# EAGLE design 77seg_panel_ends (EAGLE 6.2)
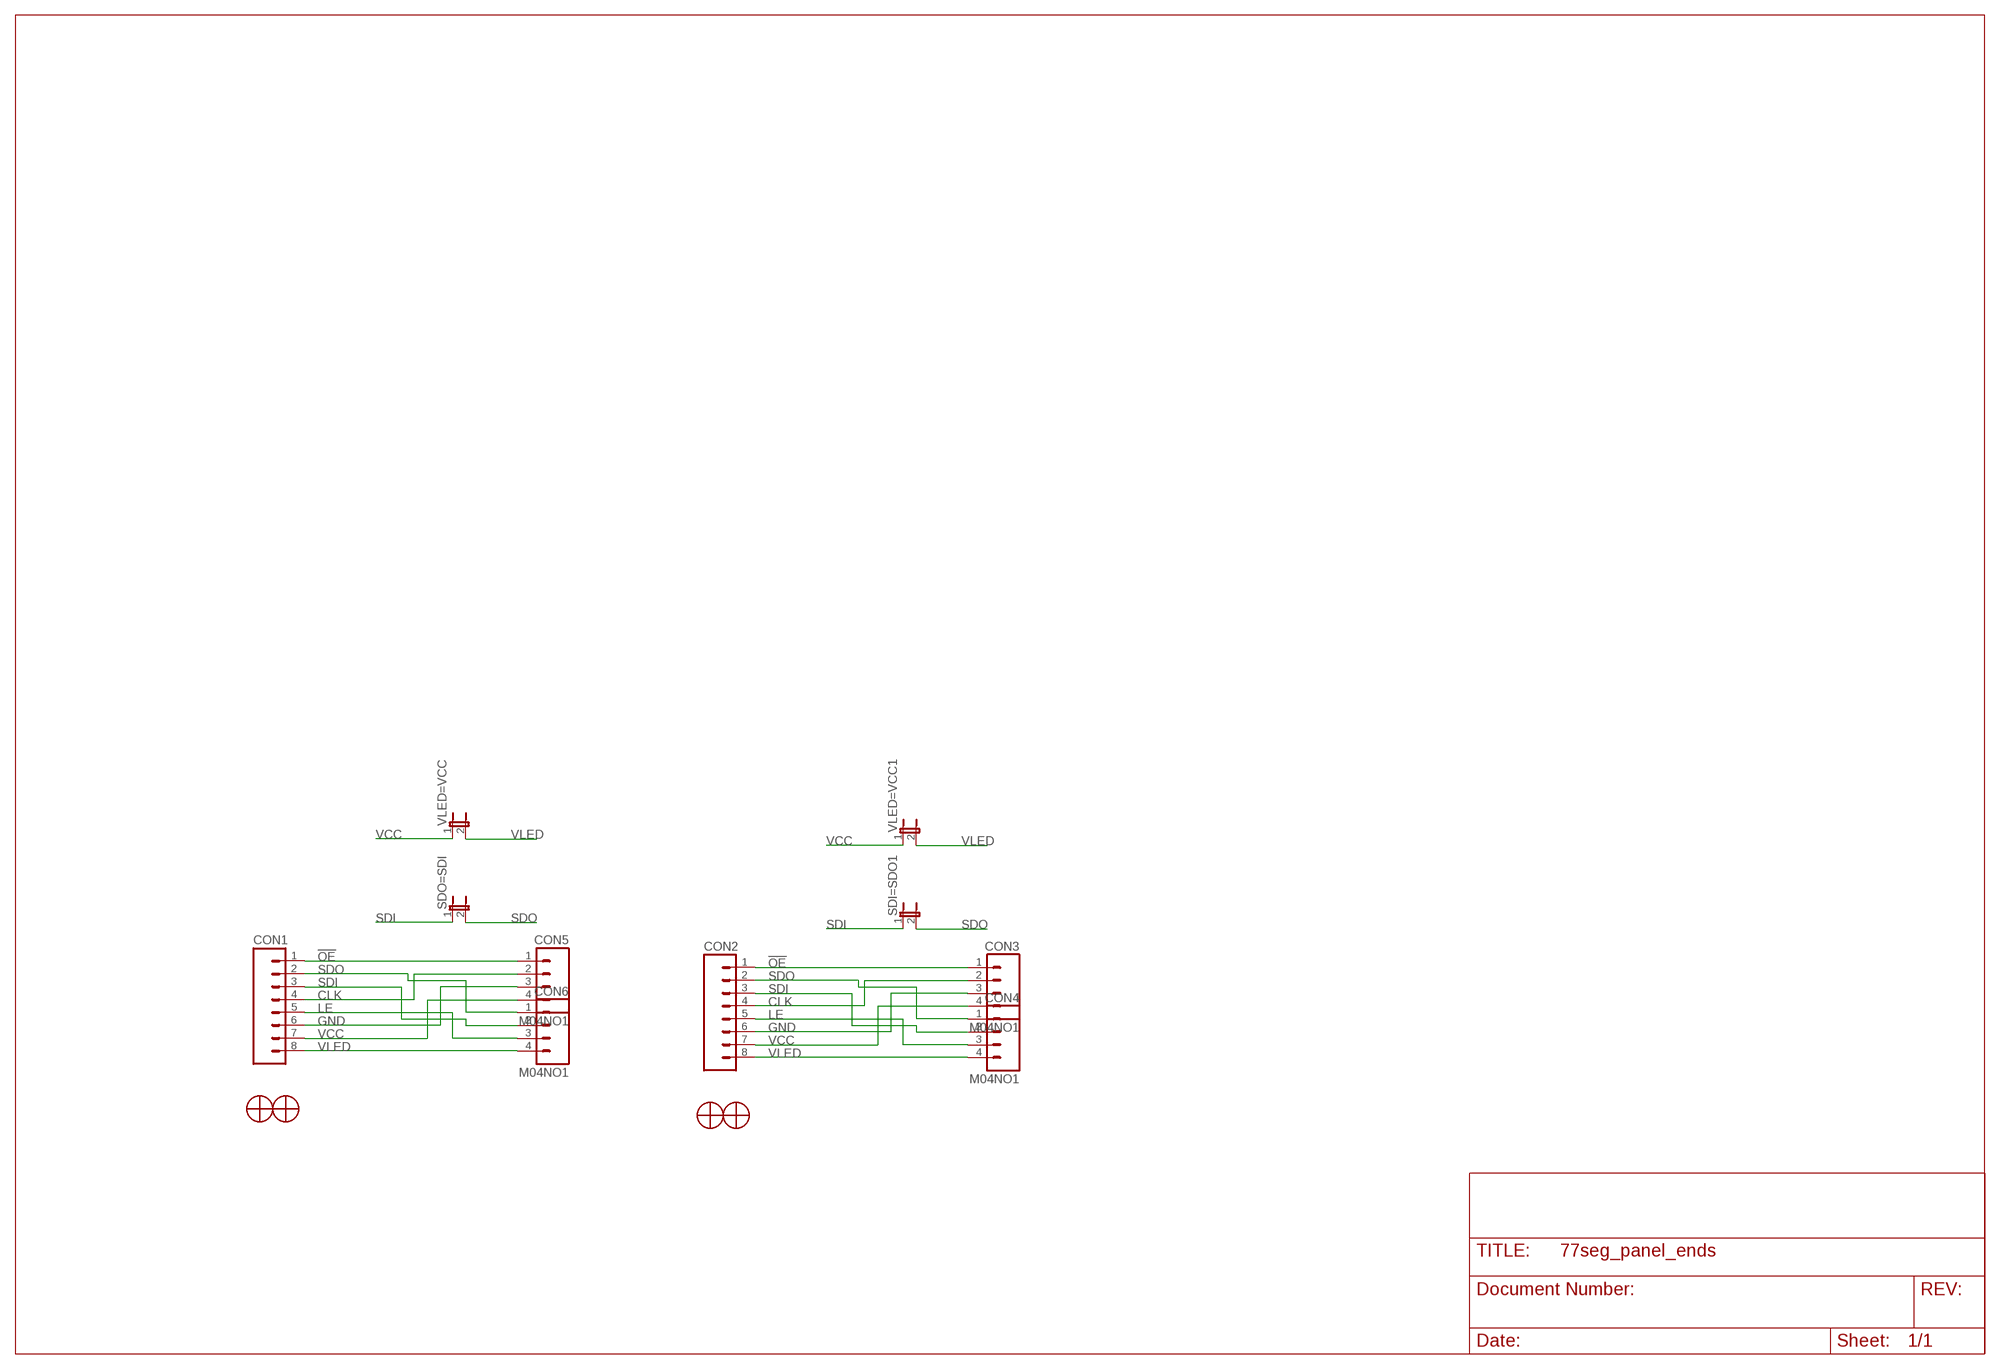
[diagram p0: schematic, sheet 1]

## Parts
CON1  M081.27MM_NO1  [1X08_1.27MM_NO1]
CON2  M081.27MM_NO1  [1X08_1.27MM_NO1]
CON3  M04NO1  [1X04_NO1]
CON4  M04NO1  [1X04_NO1]
CON5  M04NO1  [1X04_NO1]
CON6  M04NO1  [1X04_NO1]
SDI=SDO1  JUMPER-2SMD-NO  [SJ_2S-NO]
SDO=SDI  JUMPER-2SMD-NO  [SJ_2S-NO]
U$1  SCREW_NOGNDM3_REDUCED  [SCREW_M3_REDUCED]
U$2  SCREW_NOGNDM3_REDUCED  [SCREW_M3_REDUCED]
U$3  SCREW_NOGNDM3_REDUCED  [SCREW_M3_REDUCED]
U$4  SCREW_NOGNDM3_REDUCED  [SCREW_M3_REDUCED]
VLED=VCC  JUMPER-2SMD-NO  [SJ_2S-NO]
VLED=VCC1  JUMPER-2SMD-NO  [SJ_2S-NO]

## Nets
!OE: CON1.1 CON2.1 CON3.1 CON5.1
CLK: CON1.4 CON2.4 CON3.2 CON5.2
GND: CON1.6 CON2.6 CON3.3 CON5.3
LE: CON1.5 CON2.5 CON4.3 CON6.3
SDI: CON1.3 CON2.3 CON4.2 CON6.2 SDI=SDO1.1 SDO=SDI.1
SDO: CON1.2 CON2.2 CON4.1 CON6.1 SDI=SDO1.2 SDO=SDI.2
VCC: CON1.7 CON2.7 CON3.4 CON5.4 VLED=VCC1.1 VLED=VCC.1
VLED: CON1.8 CON2.8 CON4.4 CON6.4 VLED=VCC1.2 VLED=VCC.2

## Library data of the parts
CON1 CON2 = nanibox_con:M08
CON3-CON6 = nanibox_con:M04
SDI=SDO1 SDO=SDI VLED=VCC VLED=VCC1 = SparkFun:JUMPER-2: Jumper Basic 0.1" spaced jumper. Use with breakaway headers.
U$1-U$4 = nanibox:SCREW_NOGND

## Board
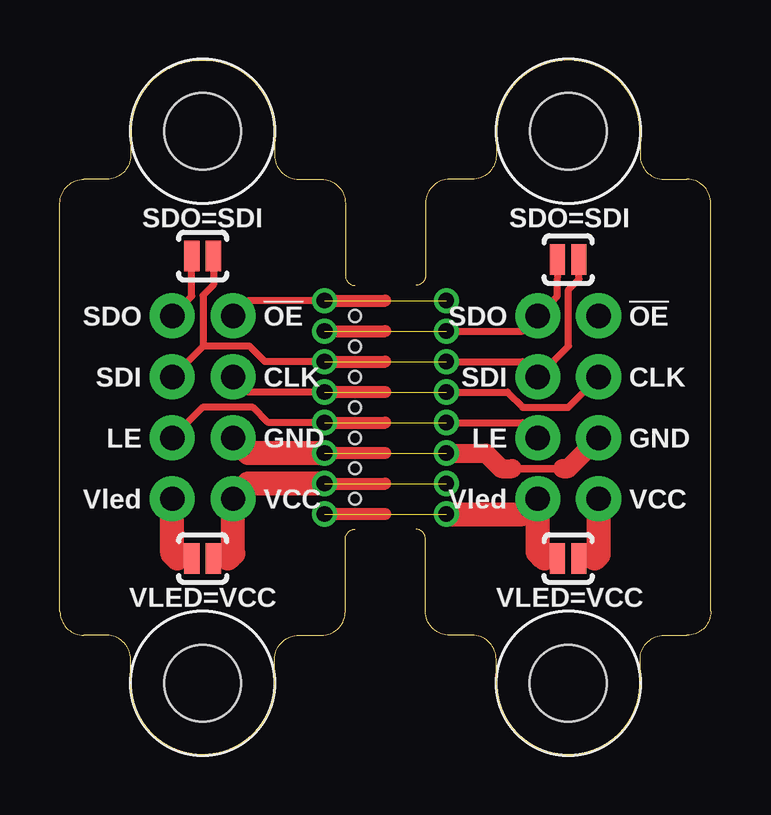
[diagram p1: board, top side]
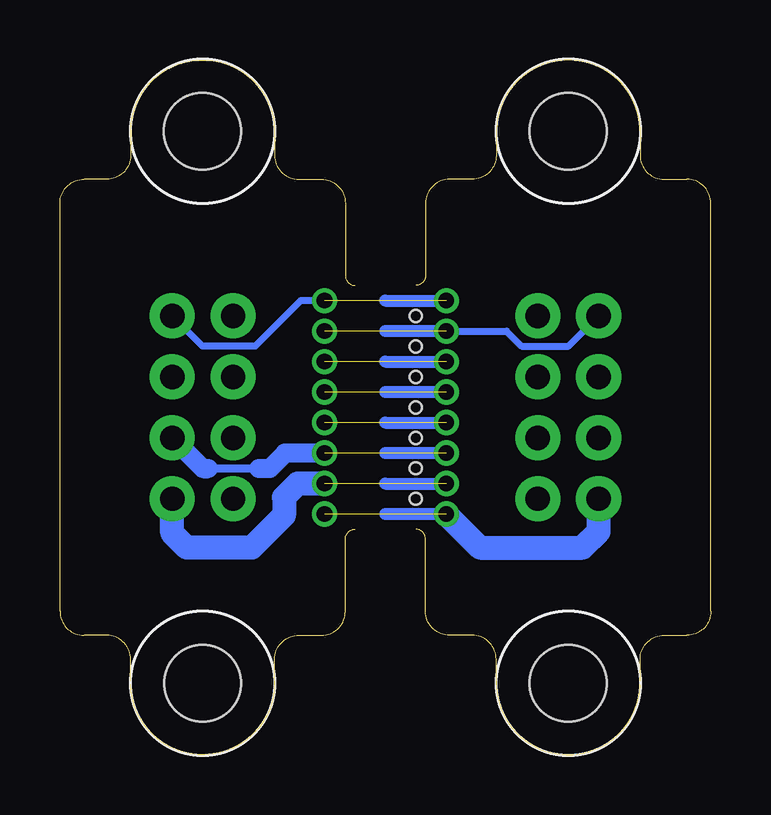
[diagram p2: board, bottom side, seen from below]

Size 27.14 x 28.95 mm. Coordinates in mm from the lower left corner, seen from the top.
Outline: 8.95,2.93 8.95,3.98 arc-90 9.95,4.98 10.9,4.98 arc90 11.9,5.98 11.9,9 arc-90 12.3,9.4
Outline: 2.95,3.08 2.95,3.98 arc90 1.95,4.98 1,4.98 arc-90 0,5.98 0,22.98 arc-90 1,23.98 1.95,23.98 arc90 2.95,24.98 2.95,26.03 arc-177 8.95,26.03 8.95,24.98 arc90 9.95,23.98 10.9,23.98 arc-90 11.9,22.98 11.9,19.96 arc90 12.3,19.55
Outline: 8.95,3.08 arc-180 2.95,2.93
Outline: 18.19,2.93 18.19,3.98 arc90 17.19,4.98 16.24,4.98 arc-90 15.24,5.98 15.24,9 arc90 14.84,9.4
Outline: 24.19,3.08 24.19,3.98 arc-90 25.19,4.98 26.14,4.98 arc90 27.14,5.98 27.14,22.98 arc90 26.14,23.98 25.19,23.98 arc-90 24.19,24.98 24.19,26.03 arc177 18.19,26.03 18.19,24.98 arc-90 17.19,23.98 16.24,23.98 arc90 15.24,22.98 15.24,19.96 arc-90 14.84,19.55
Outline: 18.19,3.08 arc180 24.19,2.93
Copper layers (1*16): Top 0.035mm / dielectric 1.5mm / Bottom 0.035mm
Design rules: minimum track width 0.15mm, minimum drill 0.3mm, track to track 0.15mm, track to pad 0.15mm, pad to pad 0.15mm, via to via 0.15mm, smd to smd 0mil, copper to edge 0.2mm, drill to drill 0.2mm, minimum pad ring 0.2mm, minimum via ring 0.15mm, stop-mask expansion 0.05mm, vias tented up to drill 2.5mm, thermal gap 0.25mm
Holes 0.5 mm at 12.3,15.75 12.3,17.02 12.3,18.29 12.3,14.48 12.3,13.21 12.3,11.94 12.3,10.67

### Footprints (pad centres in the part's own frame; a part is rotated, then mirrored left to right if it is on the bottom)
1X08_1.27MM_NO1 = drill 0.65 pad 0.9: 1 0,0; 2 1.27,0; 3 2.54,0; 4 3.81,0; 5 5.08,0; 6 6.35,0; 7 7.62,0; 8 8.89,0
1X04_NO1 = drill 1.016 pad 1.88: 1 0,0; 2 2.54,0; 3 5.08,0; 4 7.62,0
SJ_2S-NO = smd 0.635 x 1.27: 1 -0.45,0; 2 0.45,0
SCREW_M3_REDUCED = hole 3.2: 0,0

### Placement (x,y rotation side)
CON1  11.03,18.92 270 top
CON2  16.11,18.92 270 top
CON3  22.46,18.29 270 top
CON4  19.92,18.29 270 top
CON5  7.22,18.29 270 top
CON6  4.68,18.29 270 top
SDI=SDO1  21.19,20.62 180 top
SDO=SDI  5.95,20.78 180 top
U$1  5.95,2.98 0 top
U$2  5.95,25.98 0 top
U$3  21.19,2.98 0 top
U$4  21.2,25.98 0 top
VLED=VCC  5.95,8.18 180 top
VLED=VCC1  21.19,8.18 180 top

### Tracks (layer width: path | path; a pad name or v marks a point on that pad's centre or on a via)
!OE  (1 unrouted)
  Top 0.3: CON1.1 7.86,18.92 CON5.1
  Top 0.5: CON1.1 13.57,18.92
  Bottom 0.3: CON2.1 17.11,18.92 19,17.03 21.2,17.03 CON3.1
  Bottom 0.5: 13.57,18.92 CON1.1
CLK  (1 unrouted)
  Top 0.3: CON1.4 7.86,15.11 CON5.2 | CON2.4 18.66,15.11 19.3,14.48 21.19,14.48 CON3.2
  Top 0.5: 13.57,15.11 CON1.4
  Bottom 0.5: CON1.4 13.57,15.11
GND  (1 unrouted)
  Top 0.32: 18.85,11.93 20.95,11.93
  Top 0.5: 13.57,12.57 CON1.6
  Top 0.8: CON2.6 17.75,12.57 18.4,11.93 18.85,11.93 | 20.95,11.93 21.18,11.93 CON3.3
  Top 1: CON1.6 7.86,12.57 CON5.3
  Bottom 0.33: 18.85,11.93 20.95,11.93
  Bottom 0.5: CON1.6 13.57,12.57
  Bottom 0.8: CON3.3 21.18,11.93 20.95,11.93 | CON2.6 17.75,12.57 18.4,11.93 18.85,11.93
LE  (1 unrouted)
  Top 0.3: CON1.5 8.69,13.84 8.05,14.48 5.95,14.48 CON6.3 | CON2.5 19.29,13.84 CON4.3
  Top 0.5: CON1.5 13.57,13.84
  Bottom 0.5: 13.57,13.84 CON1.5
SDI  (1 unrouted)
  Top 0.3: CON1.3 8.54,16.38 7.9,17.03 5.96,17.03 | 5.96,17.03 CON6.2 | SDO=SDI.1 6.4,19.58 5.96,19.14 5.96,17.03 | CON2.3 19.29,16.38 CON4.2 21.2,17.03 21.2,19.38 21.64,19.82 SDI=SDO1.1
  Top 0.5: CON1.3 13.57,16.38
  Bottom 0.5: 13.57,16.38 CON1.3
SDO  (1 unrouted)
  Top 0.3: CON6.1 5.5,19.11 SDO=SDI.2 | CON2.2 19.29,17.65 CON4.1 20.71,19.08 SDI=SDO1.2
  Top 0.5: CON1.2 13.57,17.65
  Bottom 0.3: CON1.2 8.53,17.65 7.9,17.03 5.94,17.03 CON6.1
  Bottom 0.5: CON1.2 13.57,17.65
VCC  (1 unrouted)
  Top 0.3: 7.22,10.81 CON5.4
  Top 0.5: VLED=VCC.1 7,8.18 | VLED=VCC1.1 22.3,8.18 | CON1.7 13.57,11.3
  Top 1: 7,8.18 7.22,8.4 CON5.4 7.86,11.3 CON1.7 | 22.3,8.18 22.46,8.34 CON3.4
  Bottom 0.5: 13.57,11.3 CON1.7
  Bottom 1: CON2.7 17.23,11.3 17.8,10.73 17.8,9.98 19.15,8.63 21.85,8.63 22.46,9.24 CON3.4
VLED  (1 unrouted)
  Top 0.3: 4.63,9.28 4.68,9.23
  Top 0.5: VLED=VCC.2 4.9,8.18 | VLED=VCC1.2 20.2,8.18 | 13.57,10.03 CON1.8
  Top 1: 4.9,8.18 4.68,8.4 4.68,9.23 CON6.4 | CON2.8 19.29,10.03 CON4.4 19.92,8.46 20.2,8.18
  Bottom 0.5: CON1.8 13.57,10.03
  Bottom 1: CON1.8 9.62,8.63 5.35,8.63 4.68,9.3 CON6.4

### Text on the board
tPlace: SDO=SDI | SDO=SDI | SDO | !OE | SDO | !OE | SDI | CLK | SDI | CLK | LE | GND | LE | GND | Vled | VCC | Vled | VCC | VLED=VCC | VLED=VCC